# Altium schematic sheet Supply LDOs.SchDoc
size A4; SheetNumber: 9; SheetTotal: 10
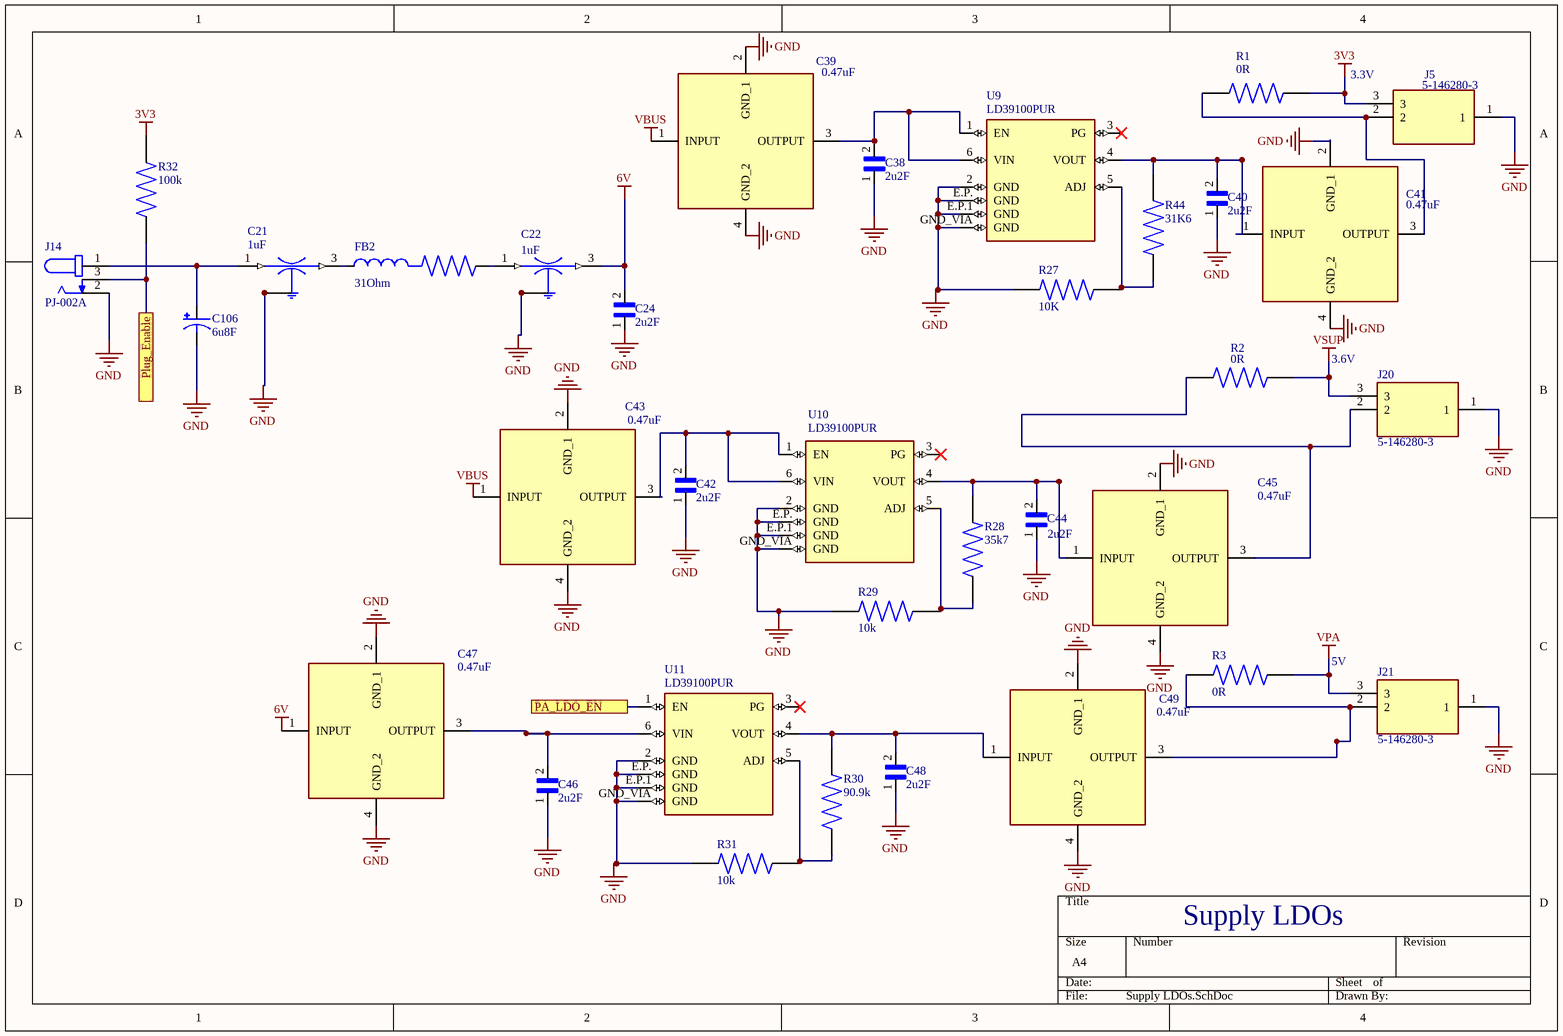
[diagram p0: Supply LDOs.SchDoc]

## Parts
C21  1uF  [FIL_NFM21PC105B1A3D]
C22  1uF  [FIL_NFM21PC105B1A3D]
C24  2u2F  [CAPC0603X35N]
C38  2u2F  [CAPC1005X55N]
C39  0.47uF  [NFM18CC101R1C3D]
C40  2u2F  [CAPC1005X55N]
C41  0.47uF  [NFM18CC101R1C3D]
C42  2u2F  [CAPC1005X55N]
C43  0.47uF  [NFM18CC101R1C3D]
C44  2u2F  [CAPC1005X55N]
C45  0.47uF  [NFM18CC101R1C3D]
C46  2u2F  [CAPC1005X55N]
C47  0.47uF  [NFM18CC101R1C3D]
C48  2u2F  [CAPC1005X55N]
C49  0.47uF  [NFM18CC101R1C3D]
C106  6u8F  [2917(POL)]
FB2  31Ohm  [FIL_NFZ32BW310HN11L]
J5  5-146280-3  [TE_5-146280-3]
J14  PJ-002A  [CUI_PJ-002A]
J20  5-146280-3  [TE_5-146280-3]
J21  5-146280-3  [TE_5-146280-3]
R1  0R  [RESC1607X60N]
R2  0R  [RESC1607X60N]
R3  0R  [RESC1607X60N]
R27  10K  [RESC1005X40N]
R28  35k7  [RESC1005X40N]
R29  10k  [RESC1005X40N]
R30  90.9k  [RES_ERJ2RKF4222X]
R31  10k  [RESC1005X40N]
R32  100k  [RESC1005X40N]
R44  31K6  [RESC1005X40N]
U9  LD39100PUR  [DFN6-3X3MM]
U10  LD39100PUR  [DFN6-3X3MM]
U11  LD39100PUR  [DFN6-3X3MM]

## Ports
PA_LDO_EN (see System Overview[1D], External interfaces and connections[1D], Microcontroller[1B]), Plug_Enable (see System Overview[1D], Microcontroller[1B])

## Nets
3V3: J5.3 R1.2 R32.2
6V: C22.3(OUT) C24.2 C47.1(INPUT)
GND: C21.2(GND) C21.2_1(GND) C21.2_2(GND) C21.2_3(GND) C21.2_4(GND) C22.2(GND) C22.2_1(GND) C22.2_2(GND) C22.2_3(GND) C22.2_4(GND) C24.1 C38.1 C39.2(GND_1) C39.4(GND_2) C40.1 C41.2(GND_1) C41.4(GND_2) C42.1 C43.2(GND_1) C43.4(GND_2) C44.1 C45.2(GND_1) C45.4(GND_2) C46.1 C47.2(GND_1) C47.4(GND_2) C48.1 C49.2(GND_1) C49.4(GND_2) C106.2(NEG) J5.1 J14.2 J20.1 J21.1 R27.2 R29.2 R31.2 U9.2(GND) U9.E.P.(GND) U9.E.P.1(GND) U9.GND_VIA(GND) U10.2(GND) U10.E.P.(GND) U10.E.P.1(GND) U10.GND_VIA(GND) U11.2(GND) U11.E.P.(GND) U11.E.P.1(GND) U11.GND_VIA(GND)
VBUS: C39.1(INPUT) C43.1(INPUT)
VPA: J21.3 R3.2
VSUP: J20.3 R2.2
PA_LDO_EN: U11.1(EN) ; port PA_LDO_EN
Plug_Enable: J14.3 R32.1 ; port Plug_Enable
NetC21_1: C21.1(IN) C106.1(POS) J14.1
NetC21_3: C21.3(OUT) FB2.1
NetC22_1: C22.1(IN) FB2.2
NetC38_2: C38.2 C39.3(OUTPUT) U9.1(EN) U9.6(VIN)
NetC40_2: C40.2 C41.1(INPUT) R44.2 U9.4(VOUT)
NetC41_3: C41.3(OUTPUT) J5.2 R1.1
NetC42_2: C42.2 C43.3(OUTPUT) U10.1(EN) U10.6(VIN)
NetC44_2: C44.2 C45.1(INPUT) R28.2 U10.4(VOUT)
NetC45_3: C45.3(OUTPUT) J20.2 R2.1
NetC46_2: C46.2 C47.3(OUTPUT) U11.6(VIN)
NetC48_2: C48.2 C49.1(INPUT) R30.2 U11.4(VOUT)
NetC49_3: C49.3(OUTPUT) J21.2 R3.1
NetR27_1: R27.1 R44.1 U9.5(ADJ)
NetR28_1: R28.1 R29.1 U10.5(ADJ)
NetR30_1: R30.1 R31.1 U11.5(ADJ)

Not connected (* = marked no-connect by the designer): U9 3(PG)*; U10 3(PG)*; U11 3(PG)*

## Notes on the sheet
- (near J5) 3.3V
- 3.6V
- 5V
- Supply LDOs

## Library data of the parts
C21 C22 = NFM21PC105B1A3D: SMD Capacitor with Capacitance: 1.0uF Tol. 20%. Rated Voltage: 10Vdc; MF: Murata; Value: *; Package: NONSTANDARD; Price: None; MP: NFM21PC105B1A3D; Availability: Unavailable; SnapEDA_Link: https://www.snapeda.com/parts/NFM21PC105B1A3D/Murata/view-part/4380627/?ref=snap
C24 = GRM033R60J225ME15D: SMD Capacitor X5R(EIA) with Capacitance: 2.2uF Tol. 20%. Rated Voltage: 6.3Vdc; Package: None; Price: None; Value: *; MP: GRM033R60J225ME15D; Availability: Unavailable
C38 C40 C42 C44 C46 C48 = GRM155R60J225ME95D: CAPACITOR, MLCC, X5R, 2.2UF, 6.3V, 0402; Package: None; Price: None; Value: *; MP: GRM155R60J225ME95D; Availability: Unavailable
C39 C41 C43 C45 C47 C49 = NFM18PS474R0J3D: Capacitor; Manufacturer_Name: Murata Electronics; Datasheet Link: https://psearch.en.murata.com/capacitor/product/NFM18PS474R0J3%23.html; Height: 0.7mm; Manufacturer_Part_Number: NFM18PS474R0J3D; Mouser Part Number: 81-NFM18PS474R0J3D; Mouser Price/Stock: https://www.mouser.co.uk/ProductDetail/Murata-Electronics/NFM18PS474R0J3D?qs=OWtbBJ4e7yHgIGJxSdBqtA%3D%3D; Arrow Part Number: NFM18PS474R0J3D; Arrow Price/Stock: https://www.arrow.com/en/products/nfm18ps474r0j3d/murata-manufacturing?region=nac
C106 = ECASD41C685M070K00: 6.8 µF 16 V Aluminum - Polymer Capacitors 2917 (7343 Metric) 70mOhm 1000 Hrs @ 105°C; MF: Murata; SnapEDA_Link: https://www.snapeda.com/parts/ECASD41C685M070K00/Murata/view-part/?ref=snap; Package: 2917 Murata; Value: *; MP: ECASD41C685M070K00; Check_prices: https://www.snapeda.com/parts/ECASD41C685M070K00/Murata/view-part/?ref=eda
FB2 = NFZ32BW310HN11L: 31 Ohms @ 1MHz 1 Ferrite Bead 2-SMD, Flat Lead 1.2A 186mOhm; MF: Murata; Availability: Warning; MP: NFZ32BW310HN11L; Price: None; Value: *; SnapEDA_Link: https://www.snapeda.com/parts/NFZ32BW310HN11L/Murata/view-part/2726849/?ref=snap; Purchase-URL: https://pricing.snapeda.com/search/part/NFZ32BW310HN11L/?ref=eda; Package: SMD-2 Murata
J5 J20 J21 = 5-146280-3: Header; Conn; Interconnect System; PCB Plug; 3 Cont; Thru-Hole; Breakaway; Straight; 3A; Centerline_Pitch: 2.54 mm[.1 in]; MF: TE Connectivity; Product_Type: Connector; Number_of_Positions: 3; SnapEDA_Link: https://www.snapeda.com/parts/5-146280-3/TE%20Connectivity%20AMP%20Connectors/view-part/2778485/?ref=snap; MP: 5-146280-3; TE_purchase_URL: https://www.te.com/usa-en/product-5-146280-3.html?te_bu=Cor&te_type=disp&te_campaign=seda_glo_cor-seda-global-disp-prtnr-fy19-seda-model-bom-cta_sma-317_1&elqCampaignId=32493; Availability: Unavailable; Price: None; Package: None; Value: *
J14 = PJ-002A: 2.0 x 6.5 mm, 2.5 A, Horizontal, Through Hole, Dc Power Jack Connector; MF: CUI Devices; MP: PJ-002A; Check_prices: https://www.snapeda.com/parts/PJ-002A/CUI+Devices/view-part/?ref=eda; Availability: In Stock; CUI_purchase_URL: https://www.cuidevices.com/product/interconnect/connectors/dc-power-connectors/jacks/pj-002a?utm_source=snapeda.com&utm_medium=referral&utm_campaign=snapedaBOM; SnapEDA_Link: https://www.snapeda.com/parts/PJ-002A/CUI+Devices/view-part/?ref=snap; Purchase-URL: https://pricing.snapeda.com/search/part/PJ-002A/?ref=eda; Price: None; Package: None; Value: *
R1-R3 = RC0603JR-070RL: Thick film general purpose; Availability: Unavailable; Package: None; MP: RC0603JR-070RL; Value: *; Price: None
R27 R29 R31 = RC0402FR-0710KL: 10 kOhms Â±1% 0.063W, 1/16W Chip Resistor 0402 (1005 Metric) Moisture Resistant Thick Film; MF: Yageo; Package: 0402 Yageo; Price: None; Check_prices: https://www.snapeda.com/parts/RC0402FR-0710KL/Yageo/view-part/?ref=eda; Value: *; SnapEDA_Link: https://www.snapeda.com/parts/RC0402FR-0710KL/Yageo/view-part/?ref=snap; MP: RC0402FR-0710KL; Availability: In Stock; Purchase-URL: https://pricing.snapeda.com/search?q=RC0402FR-0710KL&ref=eda
R28 = RC0402FR-0735K7L: RES SMD 35.7K OHM 1% 1/16W 0402; Package: None; Price: None; Value: *; MP: RC0402FR-0735K7L; Availability: Unavailable
R30 = ERJ2RKF4222X: Value: *; Package: None; MP: ERJ2RKF4222X; Price: None; Availability: Unavailable
R32 = RCG0402100KFKED: Res Thick Film 0402 100K Ohm 1% 1/16W Â±100ppm/Â°C Molded SMD; Package: None; Price: None; Value: *; MP: RCG0402100KFKED; Availability: Unavailable
R44 = RC0402FR-0731K6L: Thick film general purpose; Package: None; Price: None; Value: *; MP: RC0402FR-0731K6L; Availability: Unavailable
U9-U11 = LD39100PUR: Ð›Ð¸Ð½ÐµÐ¹Ð½Ñ‹Ð¹ Ñ€ÐµÐ³ÑƒÐ»ÑÑ‚Ð¾Ñ€ Ð½Ð°Ð¿Ñ€ÑÐ¶ÐµÐ½Ð¸Ñ IC Ñ Ð¿Ð¾Ð»Ð¾Ð¶Ð¸Ñ‚ÐµÐ»ÑŒÐ½Ñ‹Ð¼ Ñ€ÐµÐ³ÑƒÐ»Ð¸Ñ€Ð¾Ð²Ð°Ð½Ð¸ÐµÐ¼ 1 Ð²Ñ‹Ñ…Ð¾Ð´ 1A 6-DFN (3x3); MF: STMicroelectronics; SnapEDA_Link: https://www.snapeda.com/parts/LD39100PUR/STMicroelectronics/view-part/?ref=snap; Package: DFN-6 STMicroelectronics; Value: *; MP: LD39100PUR; Check_prices: https://www.snapeda.com/parts/LD39100PUR/STMicroelectronics/view-part/?ref=eda